# EAGLE design uDev C8051 (EAGLE 6.4)
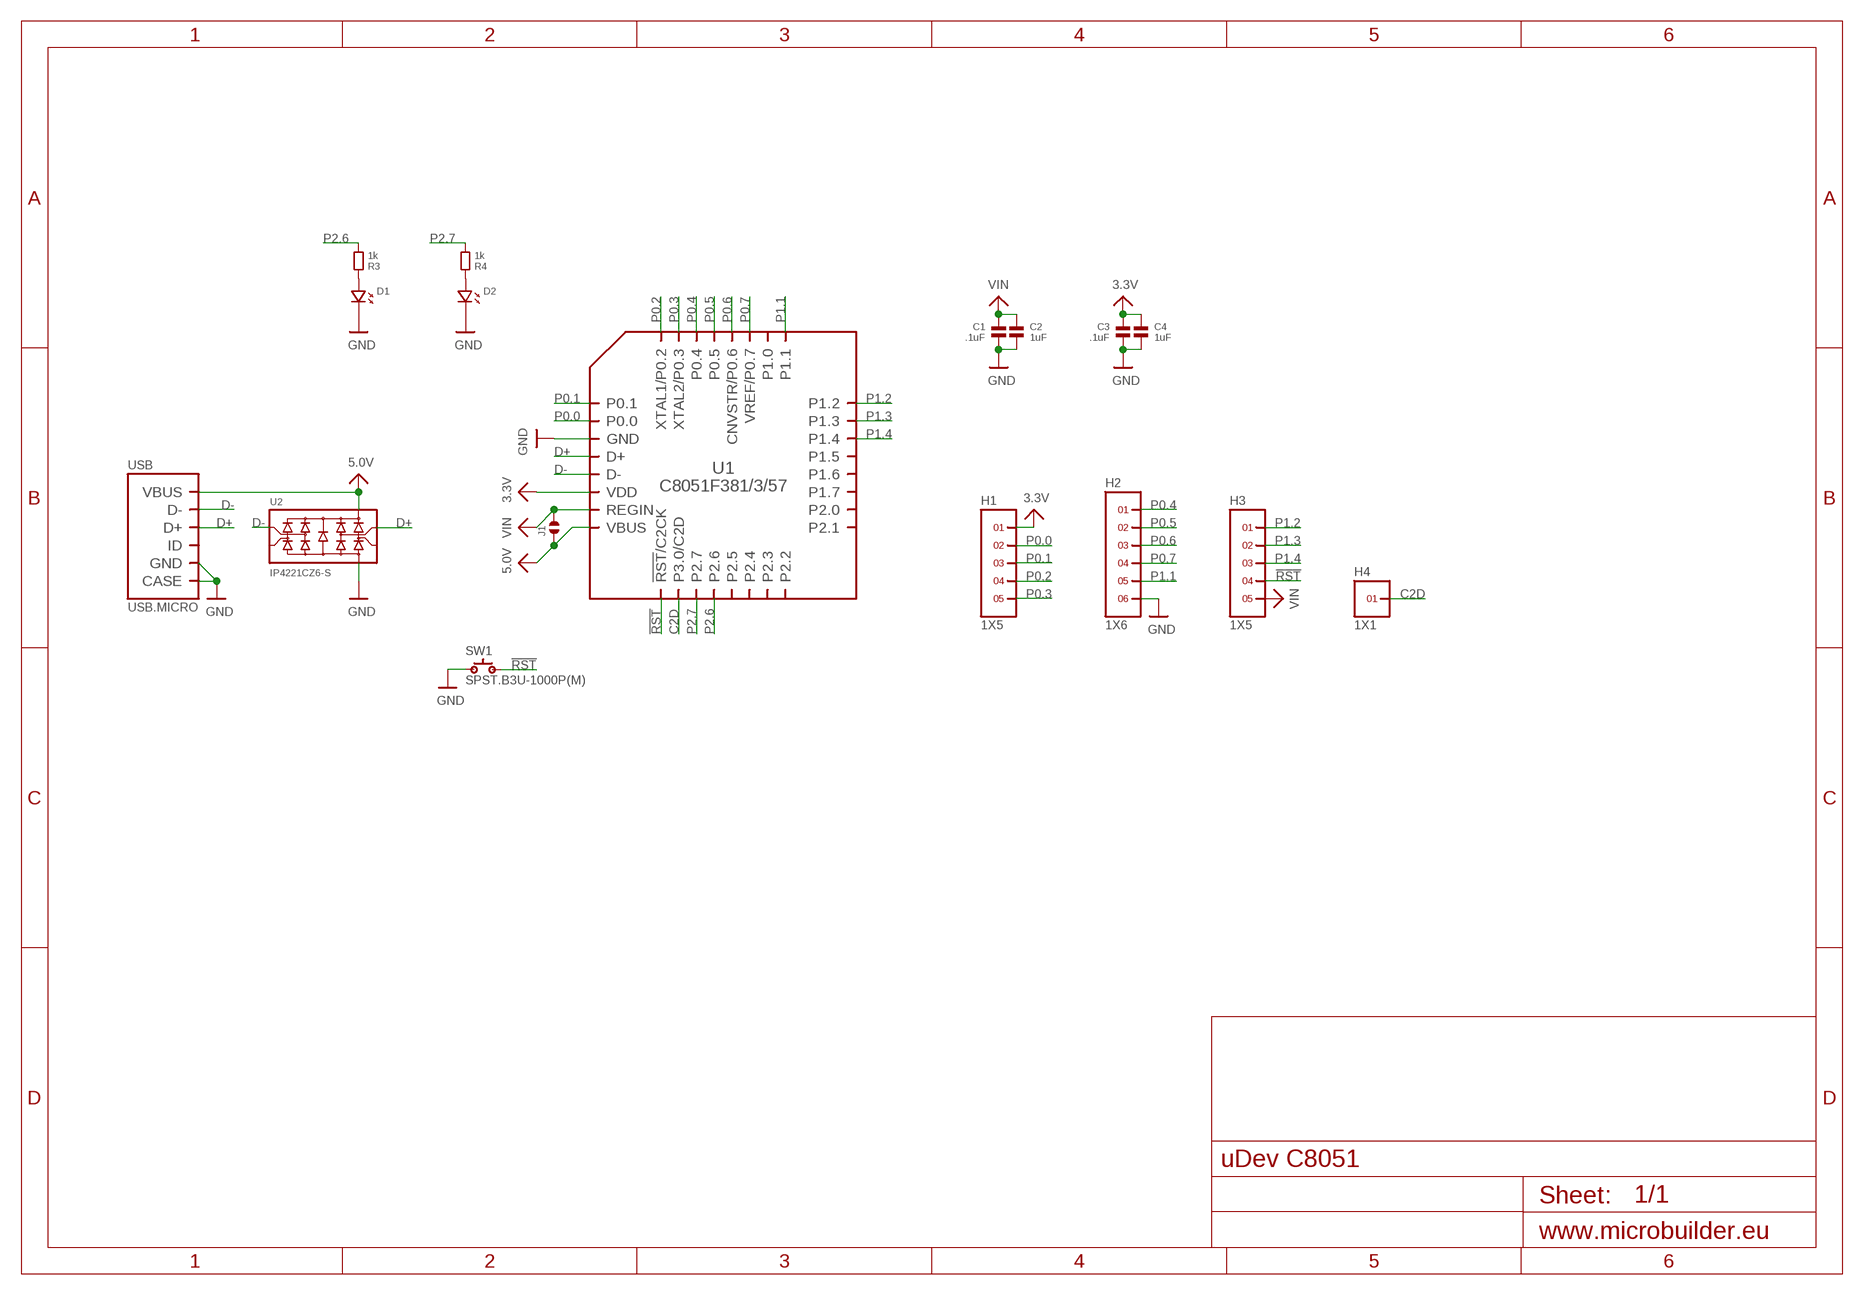
[diagram p0: schematic, sheet 1]

## Parts
C1  .1uF  CAPACITOR.0402  [0402]
C2  1uF  CAPACITOR.0402  [0402]
C3  .1uF  CAPACITOR.0402  [0402]
C4  1uF  CAPACITOR.0402  [0402]
D1  LED.0402  [0402.LED]
D2  LED.0402  [0402.LED]
H1  1X5  [1X5]
H2  1X6  [1X6]
H3  1X5  [1X5]
H4  1X1  [1X1]
J1  SOLDERJUMPER.2.SML  [2.SML]
R3  1k  RESISTOR.0402  [0402]
R4  1k  RESISTOR.0402  [0402]
SW1  SPST.B3U-1000P(M)  [B3U-1000P(M)]
U1  C8051F381/3/57  C8051F381/3/5/7.QFN  [QFN32]
U2  IP4221CZ6-S  [DFN1410-6]
USB  USB.MICRO  [1554266-1]

## Nets
3.3V: C3.1 C4.1 H1.1 U1.6(VDD)
5.0V: J1.1 U1.8(VBUS) U2.5 USB.1(VBUS)
!RST: H3.4 SW1.2 U1.9(!RST!/C2CK)
C2D: H4.1 U1.10(P3.0/C2D)
D+: U1.4(D+) U2.3 USB.3(D+)
D-: U1.5(D-) U2.1 USB.2(D-)
GND: C1.2 C2.2 C3.2 C4.2 D1.P$2 D2.P$2 H2.6 SW1.1 U1.3(GND) U1.PAD(GND) U2.2 USB.5(GND) USB.PAD1@1(CASE) USB.PAD1@2(CASE) USB.PAD1@VIA1(CASE) USB.PAD1@VIA2(CASE) USB.PAD1@VIA3(CASE) USB.PAD1@VIA4(CASE) USB.PAD1@VIA5(CASE) USB.PAD2(CASE) USB.PAD2@VIA1(CASE) USB.PAD2@VIA2(CASE) USB.PAD2@VIA3(CASE) USB.PAD2@VIA4(CASE) USB.PAD2@VIA5(CASE) USB.PAD2@VIA6(CASE) USB.PAD2@VIA7(CASE) USB.PAD3(CASE) USB.PAD3@VIA1(CASE) USB.PAD3@VIA2(CASE) USB.PAD3@VIA3(CASE) USB.PAD3@VIA4(CASE) USB.PAD3@VIA5(CASE) USB.PAD3@VIA6(CASE) USB.PAD3@VIA7(CASE) USB.PAD4@1(CASE) USB.PAD4@2(CASE) USB.PAD4@VIA1(CASE) USB.PAD4@VIA2(CASE) USB.PAD4@VIA3(CASE) USB.PAD4@VIA4(CASE) USB.PAD4@VIA5(CASE)
N$1: D1.P$1 R3.1
N$2: D2.P$1 R4.1
P0.0: H1.2 U1.2(P0.0)
P0.1: H1.3 U1.1(P0.1)
P0.2: H1.4 U1.32(XTAL1/P0.2)
P0.3: H1.5 U1.31(XTAL2/P0.3)
P0.4: H2.1 U1.30(P0.4)
P0.5: H2.2 U1.29(P0.5)
P0.6: H2.3 U1.28(CNVSTR/P0.6)
P0.7: H2.4 U1.27(VREF/P0.7)
P1.1: H2.5 U1.25(P1.1)
P1.2: H3.1 U1.24(P1.2)
P1.3: H3.2 U1.23(P1.3)
P1.4: H3.3 U1.22(P1.4)
P2.6: R3.2 U1.12(P2.6)
P2.7: R4.2 U1.11(P2.7)
VIN: C1.1 C2.1 H3.5 J1.2 U1.7(REGIN)
Unconnected: U1.13(P2.5) U1.14(P2.4) U1.15(P2.3) U1.16(P2.2) U1.17(P2.1) U1.18(P2.0) U1.19(P1.7) U1.20(P1.6) U1.21(P1.5) U1.26(P1.0) U2.4 U2.6 USB.4(ID)

## Library data of the parts
C1-C4 = standardparts:CAPACITOR
D1 D2 = standardparts:LED
H1 H3 = headers(.1in):1X5
H2 = headers(.1in):1X6
H4 = headers(2mm):1X1
J1 = solderjumper:SOLDERJUMPER.2
R3 R4 = standardparts:RESISTOR
SW1 = omron:SPST
U1 = silabs:C8051F381/3/5/7
U2 = nxp:IP4221CZ6-S
USB = te-connectivity:USB.MICRO

## Board
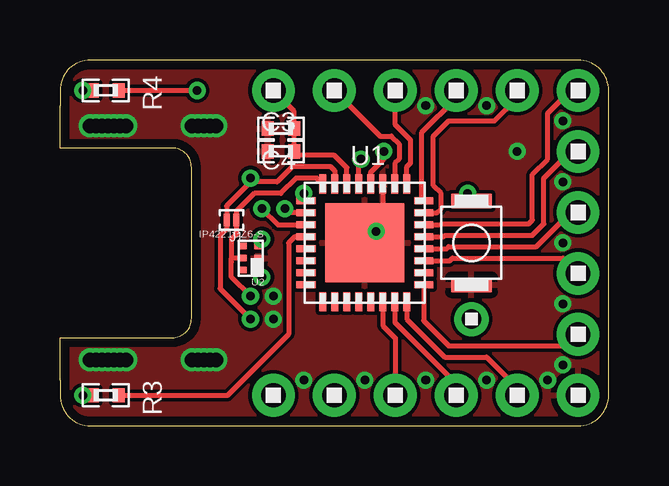
[diagram p1: board, top side]
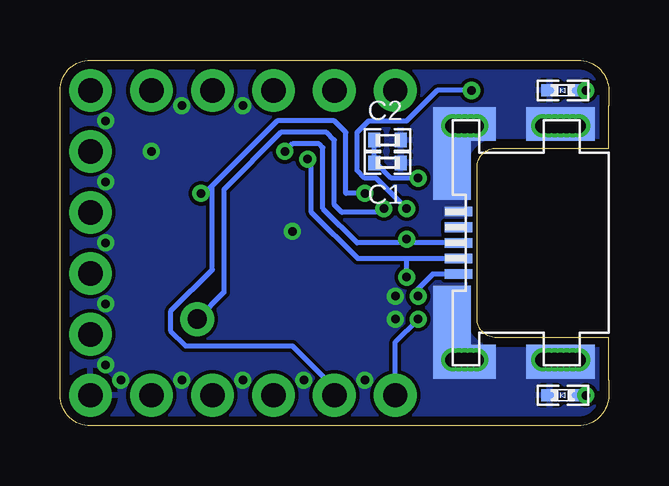
[diagram p2: board, bottom side, seen from below]

Size 22.86 x 15.24 mm. Coordinates in mm from the lower left corner, seen from the top.
Outline: 0,1.91 0,1.27 arc90 1.27,0 21.59,0 arc90 22.86,1.27 22.86,13.97 arc90 21.59,15.24 1.27,15.24 arc90 0,13.97 0,13.34
Copper layers (1*16): Top 0.0356mm / dielectric 1.5011mm / Bottom 0.0356mm
Design rules "OSHPark": minimum track width 6mil, minimum drill 13mil, track to track 6mil, track to pad 6mil, pad to pad 6mil, via to via 6mil, smd to smd 0mil, copper to edge 15mil, drill to drill 6mil, minimum pad ring 7mil, minimum via ring 7mil, stop-mask expansion 0mil, vias tented up to drill 16mil, thermal gap 10mil

### Footprints (pad centres in the part's own frame; a part is rotated, then mirrored left to right if it is on the bottom)
0402 = smd 0.5 x 0.6: 1 -0.55,0; 2 0.55,0
0402.LED = smd 0.7 x 0.5: P$1 -0.55,0; P$2 0.55,0
1X5 = drill 1.016 pad 1.778: 1 0,0; 2 2.54,0; 3 5.08,0; 4 7.62,0; 5 10.16,0
1X6 = drill 1.016 pad 1.778: 1 0,0; 2 2.54,0; 3 5.08,0; 4 7.62,0; 5 10.16,0; 6 12.7,0
1X1 = drill 0.8 pad 1.422: 1 0,0
2.SML = smd 0.254 x 0.508: 1 -0.203,0; 2 0.203,0
B3U-1000P(M) = smd 0.6 x 1.7: 1 -1.75,0; 2 1.75,0
QFN32 = smd 0.8 x 0.3: 1 -2.45,1.75; 2 -2.45,1.25; 3 -2.45,0.75; 4 -2.45,0.25; 5 -2.45,-0.25; 6 -2.45,-0.75; 7 -2.45,-1.25; 8 -2.45,-1.75; 17 2.45,-1.75; 18 2.45,-1.25; 19 2.45,-0.75; 20 2.45,-0.25; 21 2.45,0.25; 22 2.45,0.75; 23 2.45,1.25; 24 2.45,1.75 | smd 0.3 x 0.8: 9 -1.75,-2.45; 10 -1.25,-2.45; 11 -0.75,-2.45; 12 -0.25,-2.45; 13 0.25,-2.45; 14 0.75,-2.45; 15 1.25,-2.45; 16 1.75,-2.45; 25 1.75,2.45; 26 1.25,2.45; 27 0.75,2.45; 28 0.25,2.45; 29 -0.25,2.45; 30 -0.75,2.45; 31 -1.25,2.45; 32 -1.75,2.45 | smd 3.3 x 3.3: PAD 0,0
DFN1410-6 = smd 0.325 x 0.27: 1 -0.325,0.5; 2 -0.325,0; 3 -0.325,-0.5; 4 0.325,-0.5; 5 0.325,0; 6 0.325,0.5
1554266-1 = smd 0.4 x 1.15: 1 -1.3,6.25; 2 -0.65,6.25; 3 0,6.25; 4 0.65,6.25; 5 1.3,6.25 | smd 1.41 x 2.6: PAD1@1 -4.955,6; PAD4@1 4.955,6 | smd 3.86 x 1.55: PAD1@2 -3.725,6.53; PAD4@2 3.725,6.53 | drill 0.6: PAD1@VIA1 -4.875,6.5; PAD1@VIA2 -4.875,6.25; PAD1@VIA3 -4.875,6; PAD1@VIA4 -4.875,5.75; PAD1@VIA5 -4.875,5.5; PAD2@VIA1 -4.875,2.75; PAD2@VIA2 -4.875,2.5; PAD2@VIA3 -4.875,2.25; PAD2@VIA4 -4.875,2; PAD2@VIA5 -4.875,1.75; PAD2@VIA6 -4.875,1.5; PAD2@VIA7 -4.875,1.25; PAD3@VIA1 4.875,2.75; PAD3@VIA2 4.875,2.5; PAD3@VIA3 4.875,2.25; PAD3@VIA4 4.875,2; PAD3@VIA5 4.875,1.75; PAD3@VIA6 4.875,1.5; PAD3@VIA7 4.875,1.25; PAD4@VIA1 4.875,6.5; PAD4@VIA2 4.875,6.25; PAD4@VIA3 4.875,6; PAD4@VIA4 4.875,5.75; PAD4@VIA5 4.875,5.5 | smd 1.41 x 2.85: PAD2 -4.955,2; PAD3 4.955,2

### Placement (x,y rotation side)
C1  9.21,10.95 0 bottom
C2  9.21,11.91 0 bottom
C3  9.21,11.43 180 top
C4  9.21,12.38 180 top
D1  1.91,1.27 180 bottom
D2  1.91,13.97 180 bottom
H1  8.89,13.97 0 top
H2  21.59,13.97 270 top
H3  19.05,1.27 180 top
H4  17.14,4.45 0 top
J1  7.14,8.57 180 top
R3  1.91,1.27 0 top
R4  1.91,13.97 0 top
SW1  17.14,7.62 90 top
U1  12.7,7.62 270 top
U2  7.94,6.99 180 top
USB  0,7.62 90 bottom

### Tracks (layer width: path | path; a pad name or v marks a point on that pad's centre or on a via)
3.3V
  Top 0.203: U1.6 11.95,10.75 11.43,11.27 9.92,11.27 C3.1 C4.1 9.76,13.1 H1.1
5.0V  (via drill 0.36)
  Top 0.203: v7.94,5.4 7.14,6.19 7.14,6.83 7.14,6.99 | U1.8 10.7,10.32 9.84,10.32 9.21,9.68 8.1,9.68 7.35,8.93 J1.1 7.35,7.98 7.14,7.78 7.14,6.99 | U2.5 7.14,6.99
  Bottom 0.203: USB.1 7.33,6.32 7.94,5.71 v7.94,5.4
!RST  (via drill 0.36)
  Top 0.203: U1.9 10.16,9.46 v10.16,9.68 | SW1.2 17.14,9.53 v16.99,9.68
  Bottom 0.203: v10.16,9.68 10.95,9.68 10.95,12.22 11.43,12.7 13.81,12.7 15.88,10.64 16.51,10 | 16.51,10 16.83,9.68 v16.99,9.68 | H3.4 11.43,1.59 13.18,3.33 17.62,3.33 18.26,3.97 18.26,4.76 16.51,6.51 16.51,10
C2D  (via drill 0.36)
  Top 0.203: U1.10 9.54,8.87 v9.37,9.05
  Bottom 0.203: v9.37,9.05 9.53,8.89 11.11,8.89 11.43,9.21 11.43,11.91 11.75,12.22 13.65,12.22 16.03,9.84 16.03,5.56 H4.1
D+  (via drill 0.36)
  Top 0.203: U1.4 12.95,10.57 13.49,11.11 v13.49,11.43 | 8.28,7.49 U2.3 8.41,7.64 v8.41,7.78
  Bottom 0.203: v13.49,11.43 13.18,11.75 12.06,11.75 11.91,11.59 11.91,9.05 10.48,7.62 8.41,7.62 | USB.3 8.41,7.62 | v8.41,7.78 8.41,7.62
D-  (via drill 0.36)
  Top 0.203: U1.5 12.45,11.02 v12.54,11.11 | U2.1 8.41,6.33 v8.41,6.19
  Bottom 0.203: v12.54,11.11 12.38,10.95 12.38,8.89 10.46,6.97 8.41,6.97 | 8.41,6.97 USB.2 | v8.41,6.19 8.41,6.97
GND  (via drill 0.36)
  Top 0.203: U1.3 13.45,8.37 v13.18,8.1
  other vias: 8.89,5.4 8.89,4.45 20.95,5.08 12.7,1.91 10.16,1.91 19.05,11.43 15.24,1.91 17.78,1.91 20.95,10.16 20.95,7.62 20.32,1.91 20.95,2.54 17.78,13.34 15.24,13.34 20.95,12.7
  pour Bottom: 0,0 25.4,0 25.4,15.24 0,15.24
  pour Top: 0,0 25.4,0 25.4,15.24 0,15.24
N$1  (via drill 0.36)
  Top 0.203: v0.95,1.27 D1.P$1
  Bottom 0.203: D1.P$1 v0.95,1.27
N$2  (via drill 0.36)
  Top 0.203: v0.95,13.97 R4.1
  Bottom 0.203: R4.1 v0.95,13.97
P0.0
  Top 0.203: H1.2 13.34,12.06 13.81,12.06 14.13,11.75 14.13,11.11 13.95,10.93 U1.2
P0.1
  Top 0.203: U1.1 14.45,10.8 14.61,10.95 14.61,11.91 13.97,12.54 H1.3
P0.2
  Top 0.203: U1.32 15.08,9.44 15.08,12.22 16.51,13.65 H1.4
P0.3
  Top 0.203: U1.31 15.7,8.87 15.88,9.05 15.88,9.68 15.56,10 15.56,12.06 16.19,12.7 18.1,12.7 19.05,13.65 H1.5
P0.4
  Top 0.203: U1.30 15.83,8.37 15.88,8.41 19.53,8.41 19.68,8.57 19.68,10.48 20.32,11.11 20.32,13.02 21.27,13.97 H2.1
P0.5
  Top 0.203: U1.29 15.97,7.87 16.03,7.94 19.68,7.94 20.16,8.41 20.16,10.32 21.27,11.43 H2.2
P0.6
  Top 0.203: U1.28 16.1,7.37 16.19,7.46 19.84,7.46 21.27,8.89 H2.3
P0.7
  Top 0.203: U1.27 16.24,6.87 16.35,6.99 20.95,6.99 H2.4
P1.1
  Top 0.203: U1.25 15.15,4.38 16.19,3.33 21.11,3.33 H2.5
P1.2
  Top 0.203: U1.24 14.45,4.44 16.03,2.86 17.78,2.86 19.05,1.59 H3.1
P1.3
  Top 0.203: U1.23 13.95,4.31 16.51,1.75 H3.2
P1.4
  Top 0.203: U1.22 13.45,4.17 13.97,3.65 H3.3
P2.6
  Top 0.203: U1.12 9.78,7.87 9.53,7.62 9.53,3.81 6.99,1.27 R3.2
P2.7  (via drill 0.36)
  Top 0.203: v8.41,9.05 9.09,8.37 U1.11 | R4.2 v5.71,13.97
  Bottom 0.203: v5.71,13.97 7.14,13.97 8.41,12.7 10,12.7 10.48,12.22 10.48,10.64 10.16,10.32 9.68,10.32 v8.41,9.05
VIN  (via drill 0.36)
  Top 0.203: U1.7 11.45,10.62 11.27,10.79 9.68,10.79 9.05,10.16 7.94,10.16 | v7.94,4.45 6.67,5.71 6.67,7.94 6.94,8.21 J1.2 6.94,9.16 7.94,10.16 | 7.94,10.16 v7.94,10.32
  Bottom 0.203: C2.1 C1.1 9.68,10.95 9.05,10.32 v7.94,10.32 | H3.5 8.89,3.49 v7.94,4.45

### Text on the board
tDocu: 2.7 | 3.3v / 0.0 / 0.1 / 0.2 / 0.3 | !RST! | 0.4 / 0.5 / 0.6 / 0.7 / 1.1 / GND | Vin / !RST! / 1.4 / 1.3 / 1.2 | 2.6
bDocu: 2.7 | Cruz Monrreal II | uDev / C8051 | AnomalousMaker.com | 2.6